# Altium schematic sheet USB-NSTr_v3.SchDoc
size A4
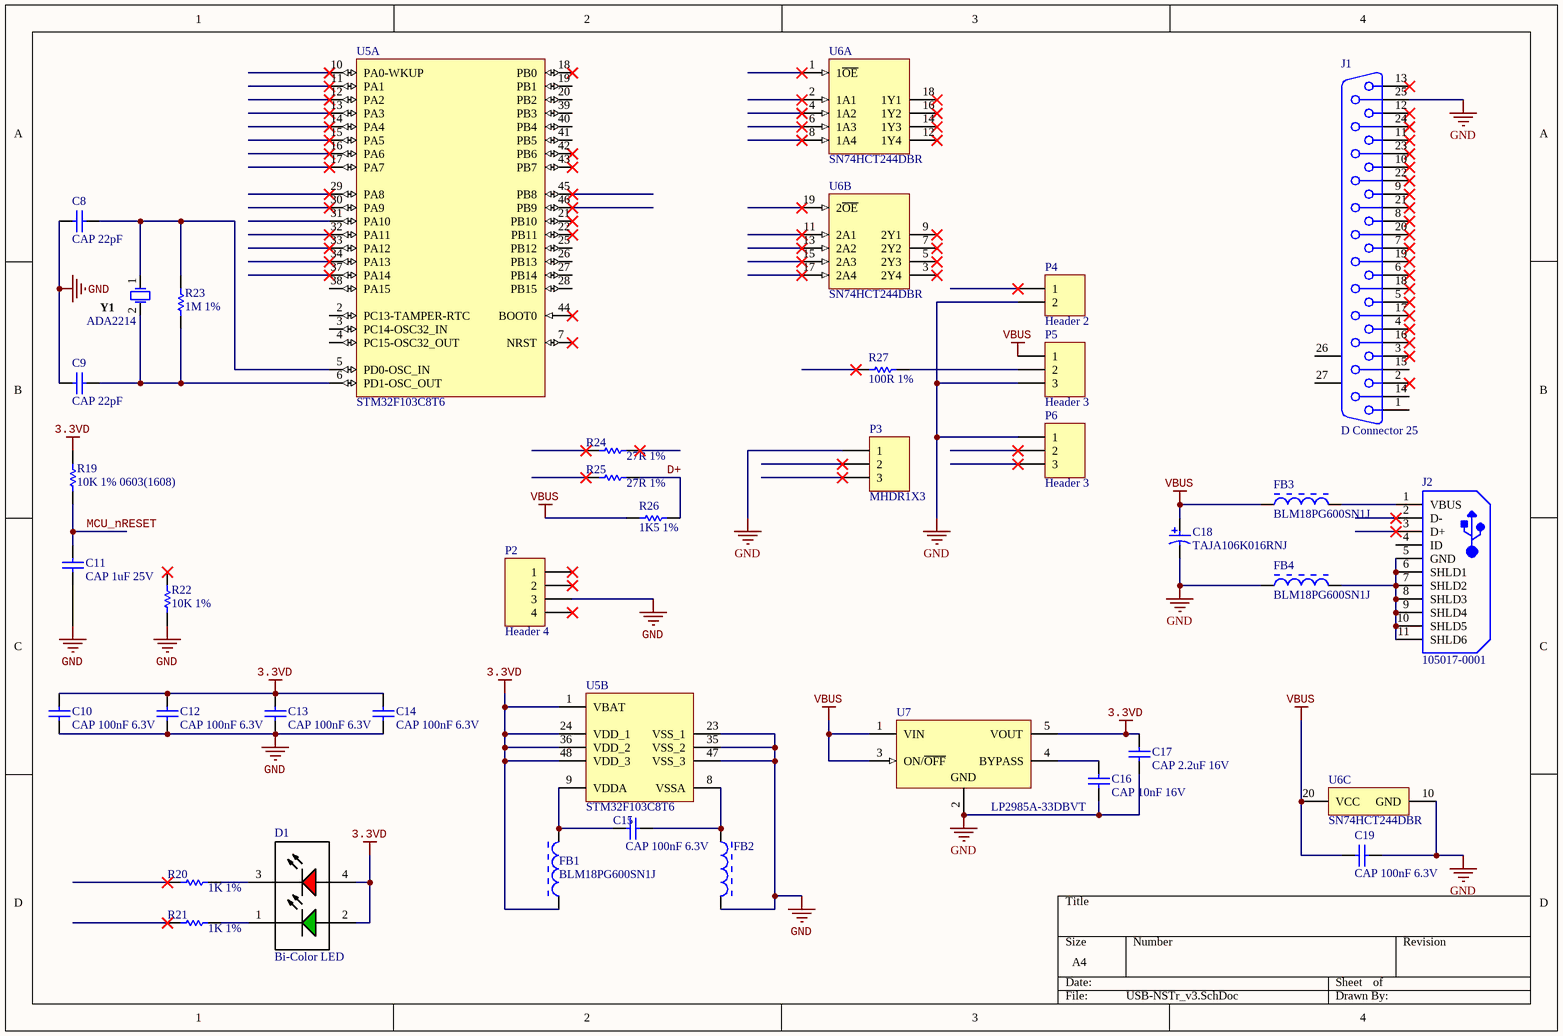
[diagram p0: USB-NSTr_v3.SchDoc]

## Parts
C8  CAP 22pF  [CAPC0603(1608)100_N]
C9  CAP 22pF  [CAPC0603(1608)100_N]
C10  CAP 100nF 6.3V  [CAPC0603(1608)100_N]
C11  CAP 1uF 25V  [CAPC0603(1608)100_N]
C12  CAP 100nF 6.3V  [CAPC0603(1608)100_N]
C13  CAP 100nF 6.3V  [CAPC0603(1608)100_N]
C14  CAP 100nF 6.3V  [CAPC0603(1608)100_N]
C15  CAP 100nF 6.3V  [CAPC0603(1608)100_N]
C16  CAP 10nF 16V  [CAPC0603(1608)100_N]
C17  CAP 2.2uF 16V  [CAPC0603(1608)55_N]
C18  TAJA106K016RNJ  [CAPMP3217X18-T_V]
C19  CAP 100nF 6.3V  [CAPC0603(1608)100_N]
D1  Bi-Color LED  [LED_Bi_Color_1204]
FB1  BLM18PG600SN1J  [MURA-BLM18PG_KG-CHIP-2_V2]
FB2  BLM18PG600SN1J  [MURA-BLM18PG_KG-CHIP-2_V2]  (value not drawn)
FB3  BLM18PG600SN1J  [MURA-BLM18PG_KG-CHIP-2_V2]
FB4  BLM18PG600SN1J  [MURA-BLM18PG_KG-CHIP-2_V2]
J1  D Connector 25  [DB25-EDGE-Female-S]
J2  105017-0001  [USB-MICRO-B_V]
P2  Header 4  [PH2.0-LI-4P]
P3  MHDR1X3  [HDR1X3]
P4  Header 2  [HDR1X2]
P5  Header 3  [HDR1X3]
P6  Header 3  [HDR1X3]
R19  10K 1% 0603(1608)  [RESC0603(1608)_N]
R20  1K 1%  [RESC0603(1608)_N]
R21  1K 1%  [RESC0603(1608)_N]
R22  10K 1%  [RESC0603(1608)_N]
R23  1M 1%  [RESC0603(1608)_N]
R24  27R 1%  [RESC0603(1608)_N]
R25  27R 1%  [RESC0603(1608)_N]
R26  1K5 1%  [RESC0805(2012)_N]
R27  100R 1%  [RESC0603(1608)_N]
U5  STM32F103C8T6  [STM-LQFP48_N]  (parts A,B of 2)
U6  SN74HCT244DBR  [DB0020A_N]  (parts A,B,C of 3)
U7  LP2985A-33DBVT  [DBV0005A_N]
Y1  ADA2214  [ADAI-THHF-49S3]

## Nets
3.3VD: C10.2 C12.2 C13.2 C14.2 C17.2 D1.2(Green-A) D1.4(Red-A) FB1.1 R19.2 U5.1(VBAT) U5.24(VDD_1) U5.36(VDD_2) U5.48(VDD_3) U7.5(VOUT)
GND: C8.2 C9.2 C10.1 C11.1 C12.1 C13.1 C14.1 C16.1 C17.1 C18.2 C19.1 FB2.2 FB4.1 J1.25 P2.3 P3.1 P4.2 P5.3 P6.1 R22.1 U5.23(VSS_1) U5.35(VSS_2) U5.47(VSS_3) U6.10(GND) U7.2(GND)
VBUS: C18.1 C19.2 FB3.1 P5.1 R26.2 U6.20(VCC) U7.1(VIN) U7.3(ON/~{OFF})
D+: R25.2 R26.1
MCU_nRESET: C11.2 R19.1
NetC8_1: C8.1 R23.2 U5.5(PD0-OSC_IN) Y1.1
NetC9_1: C9.1 R23.1 U5.6(PD1-OSC_OUT) Y1.2
NetC15_1: C15.1 FB2.1 U5.8(VSSA)
NetC15_2: C15.2 FB1.2 U5.9(VDDA)
NetC16_2: C16.2 U7.4(BYPASS)
NetD1_1: D1.1(Green-C) R21.2
NetD1_3: D1.3(Red-C) R20.2
NetFB3_2: FB3.2 J2.1(VBUS)
NetFB4_2: FB4.2 J2.5(GND) J2.6(SHLD1) J2.7(SHLD2) J2.8(SHLD3) J2.9(SHLD4) J2.10(SHLD5) J2.11(SHLD6)
NetP5_2: P5.2 R27.2

Not connected (* = marked no-connect by the designer): J1 1 2* 3* 4* 5* 6* 7* 8* 9* 10* 11* 12* 13* 14 15 16* 17* 18* 19* 20* 21* 22* 23* 24* 26(MH1) 27(MH2); J2 2(D-)* 3(D+)* 4(ID); P2 1* 2* 4*; P3 2* 3*; P4 1*; P6 2* 3*; R20 1*; R21 1*; R22 2*; R24 1* 2*; R25 1*; R27 1*; U5 2(PC13-TAMPER-RTC) 3(PC14-OSC32_IN) 4(PC15-OSC32_OUT) 7(NRST)* 10(PA0-WKUP)* 11(PA1)* 12(PA2)* 13(PA3)* 14(PA4)* 15(PA5)* 16(PA6)* 17(PA7)* 18(PB0)* 19(PB1) 20(PB2) 21(PB10)* 22(PB11)* 25(PB12) 26(PB13) 27(PB14) 28(PB15) 29(PA8)* 30(PA9)* 31(PA10) 32(PA11)* 33(PA12)* 34(PA13)* 37(PA14)* 38(PA15) 39(PB3) 40(PB4) 41(PB5) 42(PB6)* 43(PB7)* 44(BOOT0)* 45(PB8)* 46(PB9)*; U6 1(1~{OE})* 2(1A1)* 3(2Y4)* 4(1A2)* 5(2Y3)* 6(1A3)* 7(2Y2)* 8(1A4)* 9(2Y1)* 11(2A1)* 12(1Y4)* 13(2A2)* 14(1Y3)* 15(2A3)* 16(1Y2)* 17(2A4)* 18(1Y1)* 19(2~{OE})*

## Library data of the parts
C8 C9 = CMP-1035-00809-1: CAP 22pF 16V ±10% 0603 (1608 Metric) Thickness 1mm SMD; Case-EIA: 0603; Tolerance: Â±10%; Case-Metric: 1608; Value: 22pF; Rated Voltage: 16 V; Technology: SMT; Max Thickness: 1 mm
C10 C12-C15 C19 = CMP-1035-02576-1: CAP 100nF 6.3V ±10% 0603 (1608 Metric) Thickness 1mm SMD; Tolerance: Â±10%; Case-Metric: 1608; Case-EIA: 0603; Max Thickness: 1 mm; Value: 100nF; Rated Voltage: 6.3 V; Technology: SMT
C11 = CMP-1035-02741-1: CAP 1uF 25V ±20% 0603 (1608 Metric) Thickness 1mm SMD; Tolerance: Â±20%; Case-EIA: 0603; Case-Metric: 1608; Max Thickness: 1 mm; Technology: SMT; Rated Voltage: 25 V; Value: 1uF
C16 = CMP-1035-02310-1: CAP 10nF 16V ±5% 0603 (1608 Metric) Thickness 1mm SMD; Case-Metric: 1608; Case-EIA: 0603; Tolerance: Â±5%; Technology: SMT; Value: 10nF; Rated Voltage: 16 V; Max Thickness: 1 mm
C17 = CMP-1035-02764-1: CAP 2.2uF 16V ±20% 0603 (1608 Metric) Thickness 0.55mm SMD; Tolerance: Â±20%; Case-Metric: 1608; Case-EIA: 0603; Value: 2.2uF; Rated Voltage: 16 V; Max Thickness: 0.55 mm; Technology: SMT
C18 = CMP-1661-00004-1: Standard Tantalum, 10 uF, +/- 10%, 16 V, -55 to 125 degC, 2-Pin SMD (1206), RoHS, Tape and Reel; Frequency: 300 MHz; Vce Max: 500 mV; hFE Min: 60; Elements: 2; Case\Package: SOT-26; Max Power Dissipation: 300 mW; Min Operating Temperature: -55 degC; Width: 1.7 mm; ComponentLink2URL: http://datasheets.avx.com/TAJ.pdf; PackageDescription: 2-Pin Surface Mount Device, Body 3.2 x 1.65 mm; RoHSCompliant: true; ComponentLink2Description: Datasheet; Package Quantity: 3000; Max Operating Temperature: 150 degC; Length: 3.1 mm; Mount: Surface Mount; Packaging: Tape and Reel; ComponentLink1URL: http://www.avx.com/; ComponentLink1Description: Manufacturer URL; DatasheetVersion: Feb-16; ComponentLink3URL: http://www.avx.com/download/software/literature/AVX-Footprint-Library.pdf; ComponentLink3Description: Package Specification; Height: 1.3 mm; PackageReference: CAPMP3217X18-T; REACH SVHC: No SVHC; Pins: 6; Radiation Hardening: No
D1 = LED-RG-KAAK-4: LED Indicator, Red / Green, 2 V, -40 to 100 degC, 4-Pin SMD, RoHS, Tape and Reel; Manufacturer: Dialight; Forward Voltage: 2.6V; Rad Hardened: No; Reverse Voltage: 5V; Product Length (mm): 4.3mm; Dominant Wave Length: 570/628nm; Forward Current: 30mA; Lens Type: NonDiffused; Shape Type: Circular; Product Depth (mm): 8.8mm; Number of  Elements: 2; Power Dissipation: 100W; Luminous Intensity: 8/6.5mcd; Main Category: ChipLED; DELETED: Compliant; Test Current (It): 20mA; Emitting Color: YellowGreen/Red; Viewing Angle: 40deg; Product Height (mm): 5mm; Pin Count: 2; Operating Temp Range: -55Cto100C; Package Type: SMD; Type: Bi-Color; High Brightness: No; Packaging: TapeandReel; Package Description: 4-Pin Surface Mount Device, Body 4.32 x 8.77 mm, Pitch 1.5 mm; Operating Temperature Classification: Industrial; Lens Dimensions: 2.8x2.8x2.7mm; Mounting Technology: SurfaceMount; Datasheet Version: Rev. B, 10/2010; Lum Intensity: 8/6.5mcd; Package Reference: 591-3001-013F; Mounting: SurfaceMount; Manufacturer URL: http://www.dialight.com/; Datasheet URL: https://datasheet.ciiva.com/2132/c17245-2132277.pdf
FB1-FB4 = CMP-0686-00574-2: Chip Ferrite Bead for Power Lines, 60 Ohm, 500 mA, -55 to 125 degC, 1.6 x 0.8 x 0.95 mm SMD, Tape and Reel; Manufacturer: Murata; Impedance (at 100 MHz): 60 Ohm Typ.; Rated Current: 500 mA; DC Resistance: 0.10 Ohm Max.; ComponentLink2URL: http://www.murata.com/products/catalog/pdf/c31e.pdf; ComponentLink1Description: Manufacturer URL; Operating Temperature Range: -55 to 125 degC; DatasheetVersion: 08/2013; PackageDescription: 2-Pin Chip, Body 1.6 x 0.8 mm; PackageReference: BLM18_H950-2; ComponentLink2Description: Datasheet; PartNumber: BLM18PG600SN1J; Mounting Technology: Surface Mount; ComponentLink3URL: http://www.murata.com/products/catalog/pdf/c31e.pdf; ComponentLink3Description: Package Specification; Packing: Tape and Reel; ComponentLink1URL: http://www.murata.com/
J1 = D Connector 25: Receptacle Assembly, 25 Position, Right Angle; PackageDocument: U; Positions: 25; Published: 15-Jun-2001; LatestRevisionDate: 17-Jul-2002; LatestRevisionNote: Re-released for DXP Platform.; DatasheetDocument: 19-Mar-1999; PackageReference: 787202; Publisher: Altium Limited; Orientation: Right Angle; Gender: Receptacle
J2 = CMP-2000-05827-1: Micro-USB B Receptacle, Right Angle, Bottom Mount, Surface Mount, with Solder Tabs, -30 to 85 degC, 5-Pin USB, RoHS, Tape and Reel; Manufacturer: Molex; Featured Product: Micro-USBConnectorsUSBConnectors; Other Names: WM1399DKR; Package Version: Rev. F, 12/2012; Number of Contacts: 5; Connector Type: USB-microB; Catalog Drawings: 1050170001; 3D Model: 105017-0001.stp; Mating Products: WM17145-ND-CABLEMICROUSBBTOSTDA1.0MWM17147-ND-CABLEMICROUSBBTOSTDA2.0MWM17146-ND-CABLEMICROUSBBTOSTDA1.5M; PCN Assembly/Origin: ResinSupplier21/Oct/2015; Voltage - Max: 30V; Online Catalog: Molex-MicroUSB; Manufacturer URL: http://www.molex.com/; Package Description: 5-Leads USB, Micro B, Body 7.5 x 5 mm, Pitch 0.65 mm; Datasheet URL: http://www.molex.com/elqNow/elqRedir.htm?ref=http://www.molex.com/webdocs/datasheets/pdf/en-us/1050170001_IO_CONNECTORS.pdf; Ingress Protection: -; Datasheet Version: 03/2016; Mounting Type: BoardCutout,SurfaceMount,RightAngle; Circuits: 5; Standard Package: 1; Package Reference: MICRO-B; Package URL: http://www.molex.com/pdm_docs/sd/1050170001_sd.pdf; Category: Connectors,Interconnects; Series: -; RoHS Information: 1050170001CertofCompliance; Features: Shielded,SolderRetention; Family: USB,DVI,HDMIConnectors; Specifications: -; Gender: Receptacle; Packaging: Digi-Reel®; Mounting Technology: SurfaceMount
P2 = Header 4: Header, 4-Pin; LatestRevisionDate: 17-Jul-2002; LatestRevisionNote: Re-released for DXP Platform.; Publisher: Altium Limited
P3 = MHDR1X3: Header, 3-Pin; LatestRevisionDate: 17-Jul-2002; LatestRevisionNote: Re-released for DXP Platform.; Publisher: Altium Limited
P4 = Header 2: Header, 2-Pin; LatestRevisionDate: 17-Jul-2002; LatestRevisionNote: Re-released for DXP Platform.; Publisher: Altium Limited
P5 P6 = Header 3: Header, 3-Pin; LatestRevisionDate: 17-Jul-2002; LatestRevisionNote: Re-released for DXP Platform.; Publisher: Altium Limited
R19 R22 = CMP-1012-00623-1: 10K 0.1W 1% 0603 (1608 Metric)  SMD; Value: 10000.00 Ohm; Case-EIA: 0603; Case-Metric: 1608; Power: 0.1 W; Tolerance: 1 %; Technology: SMT
R20 R21 = CMP-1012-00510-1: 1K 0.1W 1% 0603 (1608 Metric)  SMD; Case-Metric: 1608; Case-EIA: 0603; Value: 1000.00 Ohm; Technology: SMT; Tolerance: 1 %; Power: 0.1 W
R23 = CMP-1012-00849-1: 1M 0.1W 1% 0603 (1608 Metric)  SMD; Value: 1000000.00 Ohm; Case-EIA: 0603; Case-Metric: 1608; Power: 0.1 W; Tolerance: 1 %; Technology: SMT
R24 R25 = CMP-1012-00331-1: 27R 0.1W 1% 0603 (1608 Metric)  SMD; Case-EIA: 0603; Value: 27.00 Ohm; Case-Metric: 1608; Technology: SMT; Tolerance: 1 %; Power: 0.1 W
R26 = CMP-1013-00528-1: 1K5 0.125W 1% 0805 (2012 Metric)  SMD; Value: 1500.00 Ohm; Case-Metric: 2012; Case-EIA: 0805; Technology: SMT; Power: 0.125 W; Tolerance: 1 %
R27 = CMP-1012-00397-1: 100R 0.1W 1% 0603 (1608 Metric)  SMD; Value: 100.00 Ohm; Case-EIA: 0603; Case-Metric: 1608; Technology: SMT; Tolerance: 1 %; Power: 0.1 W
U5 = CMP-0237-00215-3: ARM Cortex-M3 32-bit MCU, 64 KB Flash, 20 KB Internal RAM, 37 I/Os, 48-pin LQFP, -40 to 85 degC, Tray; Supply Voltage(Vcc) min (V): 2; Internal RAM Size (kB): 20; FLASH Size (Prog) (kB): 64; A/D Converter: 2x12-bit (10 Channel); I/Os (High Current): 37; Operating Frequency(F) (Processor speed) (MHz): 72; Core: ARM Cortex-M3; ComponentLink3Description: Package Specification; Mounting Technology: Surface Mount; PartNumber: STM32F103C8T6; PackageReference: LQFP48; Packing: Tray; ComponentLink3URL: http://www.st.com/st-web-ui/static/active/en/resource/technical/document/datasheet/DM00058181.pdf; DatasheetVersion: Rev. 16; ComponentLink1URL: http://www.st.com/web/en/home.html; PackageVersion: Rev. 6, 06/2013; ComponentLink2URL: http://www.st.com/st-web-ui/static/active/en/resource/technical/document/datasheet/CD00161566.pdf; ComponentLink1Description: Manufacturer URL; ComponentLink2Description: Datasheet; PackageDescription: 48-Pin Low Profile Quad Flat Package, 7 x 7 mm Body, 0.5 mm Pitch; PartId: 1
U6 = CMP-0440-00427-3: Octal Buffers And Line Drivers With 3-State Outputs, DB0020A, LARGE T&R; Manufacturer: Texas Instruments; tpd @ Nom Voltage(Max)(ns): 32; Rating: Catalog; VCC(Min)(V): 4.5; F @ Nom Voltage(Max)(Mhz): 25; ICC @ Nom Voltage(Max)(mA): 0.08; Output Type: CMOS; VCC(Max)(V): 5.5; Voltage(Nom)(V): 5; Input Type: TTL; Bits(#): 8; DatasheetVersion: SCLS175D; Operating Temperature Range(C): -40 to 85; PackageVersion: http://www.ti.com/lit/ml/mpds508/mpds508.pdf; Generic Part Number: SN74HCT244; PackageReference: DB0020A; Code_JEDEC: MO-150; PartId: 1
U7 = CMP-0758-00051-2: Single Output Low Noise LDO, 150 mA, Fixed 3.3 V Output, 1% Tolerance, 2.2 to 16 V Input, Low IQ, 5-Pin SOT-23 (DBV), -40 to 125 degC, Green (RoHS & no Sb/Br), Tape and Reel; Manufacturer: Texas Instruments; Vdo (Typ) (mV): 280; Fixed Output Options (V): 3.3; Output Options: Fixed Output; Accuracy (%): 1; Iout (Max) (A): 0.15; Iq (Typ) (mA): 0.85; PackageDescription: 5-Pin Plastic Small Outline, Body 2.9 x 1.6 mm, Pitch 0.95 mm; Operating Temperature Range (degC): -40 to 125; PackageVersion: 4073253-4/L; ComponentLink3URL: http://www.ti.com/litv/pdf/mpds018j; PartNumber: LP2985A-33DBVT; Mounting Technology: Surface Mount; ComponentLink3Description: Package Specification; ComponentLink1Description: Manufacturer URL; DatasheetVersion: SLVS522N; PackageReference: DBV0005A; RoHS: TRUE; Vin (V): 2.2 to 16; Packing: Tape and Reel; ComponentLink2URL: http://www.ti.com/lit/ds/symlink/lp2985-50.pdf; ComponentLink2Description: Datasheet; ComponentLink1URL: http://www.ti.com/
Y1 = CMP-1740-00004-1: Crystal, 12 MHz, 18 pF, 30 PPM, -20 to 70 degC, 2-Pin THD, RoHS; Elements: 1; Max Dual Supply Voltage: 15 V; Propagation Delay: 115 ns; Nominal Dual Supply Voltage: 12 V; Case\Package: PDIP; Min Supply Voltage: 3.5 V; Min Dual Supply Voltage: 1.75 V; Nominal Voltage Gain: 106.02 dB; Nominal Supply Current: 7.5 mA; Max Supply Voltage: 30 V; PackageDescription: 2-Pin Through Hole Device, Body 11.05 x 4.65 mm, Pitch 4.88 mm; Length: 9.81 mm; ComponentLink2URL: https://cdn-shop.adafruit.com/product-files/2214/2214datasheet.pdf; REACH SVHC: No SVHC; PackageReference: THHF-49S3; DatasheetVersion: Nov-14; ComponentLink1URL: https://www.adafruit.com/; Height: 4.57 mm; Width: 6.35 mm; Channels: 1; ComponentLink2Description: Datasheet; Max Operating Temperature: 70 degC; Packaging: Rail/Tube; Nominal Supply Voltage: 12 V; Weight: 0.015535 oz; Package Quantity: 50; RoHSCompliant: true; Radiation Hardening: No; Pins: 8; ComponentLink1Description: Manufacturer URL; Min Operating Temperature: 0 degC; Mount: Through Hole